# EAGLE design playPack (EAGLE 5.11)
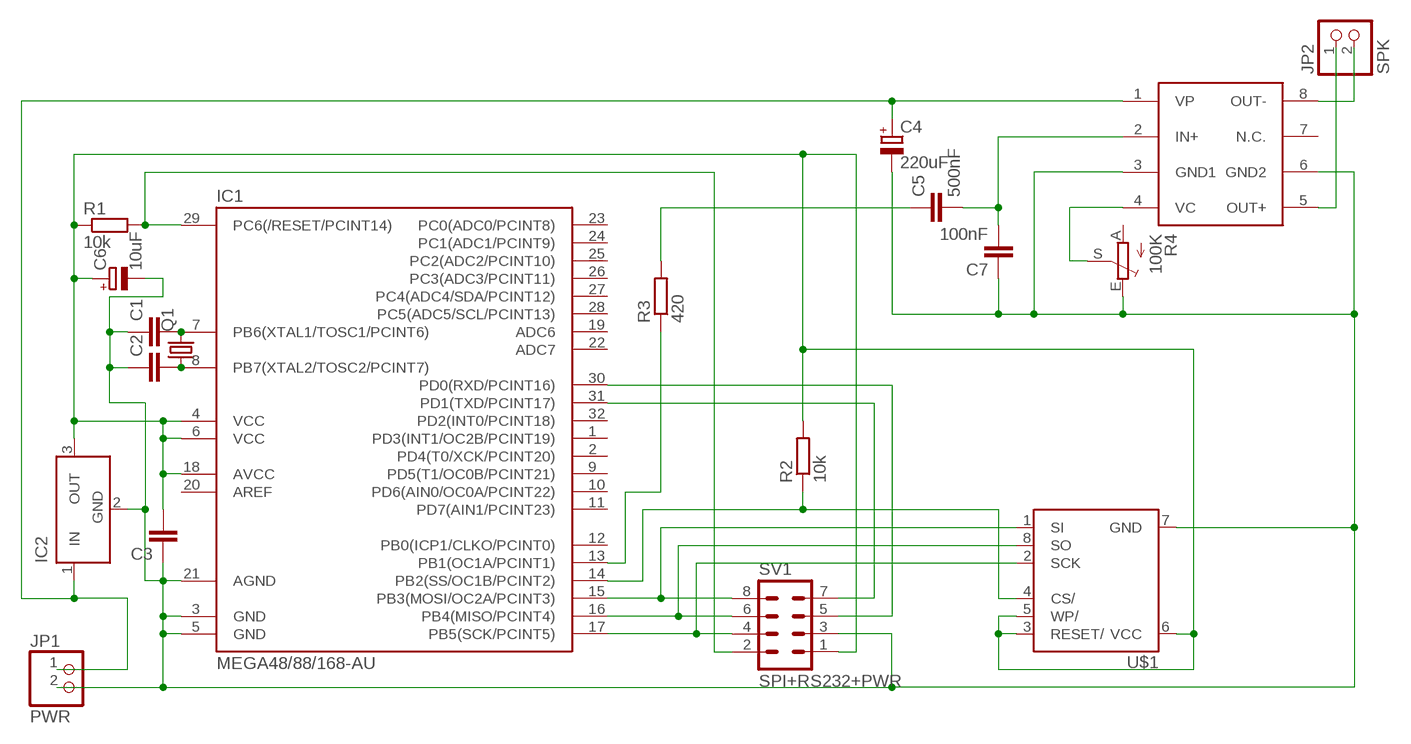
[diagram p0: schematic, sheet 1]

## Parts
C1  C-EUC0603  [C0603]
C2  C-EUC0603  [C0603]
C3  C-EUC0603  [C0603]
C4  220uF  CPOL-EUE2,5-6E  [E2,5-6E]
C5  500nF  C-EUC0402  [C0402]
C6  10uF  CPOL-EUE1.8-4  [E1,8-4]
C7  100nF  C-EUC0402  [C0402]
IC1  MEGA48/88/168-AU  [TQFP32-08]
IC2  LT1129CST5  [SOT223]
JP1  PWR  PINHD-1X2  [1X02]
JP2  SPK  PINHD-1X2  [1X02]
Q1  CRYTALHC49U-V  [HC49U-V]
R1  10k  R-EU_R0603  [R0603]
R2  10k  R-EU_R0603  [R0603]
R3  420  R-EU_R0603  [R0603]
R4  100K  TRIM_EU-LI10  [LI10]
SV1  SPI+RS232+PWR  MA04-2  [MA04-2]
U$1  AT45SO  [SOIC8]
U$2  TDA7052A  [SO8]

## Nets
#RESET: IC1.29(PC6(/RESET/PCINT14)) R1.2 SV1.2
GND: C1.1 C2.1 C3.1 C4.- C6.- C7.1 IC1.3(GND) IC1.5(GND) IC1.21(AGND) IC2.2(GND) JP1.2 R4.E SV1.3 U$1.7(GND) U$2.3(GND1) U$2.6(GND2)
MISO: IC1.16(PB4(MISO/PCINT4)) SV1.6 U$1.8(SO)
MOSI: IC1.15(PB3(MOSI/OC2A/PCINT3)) SV1.8 U$1.1(SI)
N$1: C5.1 R3.2
N$8: C1.2 IC1.7(PB6(XTAL1/TOSC1/PCINT6)) Q1.2
N$9: C2.2 IC1.8(PB7(XTAL2/TOSC2/PCINT7)) Q1.1
N$10: JP2.1 U$2.5(OUT+)
N$11: JP2.2 U$2.8(OUT-)
N$12: R4.S U$2.4(VC)
N$17: C5.2 C7.2 U$2.2(IN+)
PWM: IC1.13(PB1(OC1A/PCINT1)) R3.1
RXD: IC1.30(PD0(RXD/PCINT16)) SV1.5
SCK: IC1.17(PB5(SCK/PCINT5)) SV1.4 U$1.2(SCK)
SS: IC1.14(PB2(SS/OC1B/PCINT2)) R2.1 U$1.4(CS/)
TXD: IC1.31(PD1(TXD/PCINT17)) SV1.7
V33: C3.2 C6.+ IC1.4(VCC) IC1.6(VCC) IC1.18(AVCC) IC2.3(OUT) R1.1 R2.2 SV1.1 U$1.3(RESET/) U$1.5(WP/) U$1.6(VCC)
VCC: C4.+ IC2.1(IN) JP1.1 U$2.1(VP)
Unconnected: IC1.1(PD3(INT1/OC2B/PCINT19)) IC1.2(PD4(T0/XCK/PCINT20)) IC1.9(PD5(T1/OC0B/PCINT21)) IC1.10(PD6(AIN0/OC0A/PCINT22)) IC1.11(PD7(AIN1/PCINT23)) IC1.12(PB0(ICP1/CLKO/PCINT0)) IC1.19(ADC6) IC1.20(AREF) IC1.22(ADC7) IC1.23(PC0(ADC0/PCINT8)) IC1.24(PC1(ADC1/PCINT9)) IC1.25(PC2(ADC2/PCINT10)) IC1.26(PC3(ADC3/PCINT11)) IC1.27(PC4(ADC4/SDA/PCINT12)) IC1.28(PC5(ADC5/SCL/PCINT13)) IC1.32(PD2(INT0/PCINT18)) R4.A U$2.7(N.C.)

## Power pins joined to a net without a drawn wire
GND: IC2.4(GND)

## Library data of the parts
C1-C3 C5 C7 = rcl:C-EU: CAPACITOR, European symbol
C4 C6 = rcl:CPOL-EU: POLARIZED CAPACITOR, European symbol
IC1 = avr-4:MEGA48/88/168
IC2 = linear-technology:LT1129CST5: VOLTAGE REGULATOR with shutdown
JP1 JP2 = pinhead:PINHD-1X2: PIN HEADER
Q1 = crystal:CRYTAL: CRYSTAL
R1-R3 = rcl:R-EU_: RESISTOR, European symbol
R4 = pot:TRIM_EU-: POTENTIOMETER
SV1 = con-lstb:MA04-2: PIN HEADER
U$1 = at45dataflash:AT45*: ATMEL AT45DB041 AT45DB081 Dataflash 1 / 2 / 4 / 8 MBit SO8
U$2 = playPack:TDA7052A

## Board
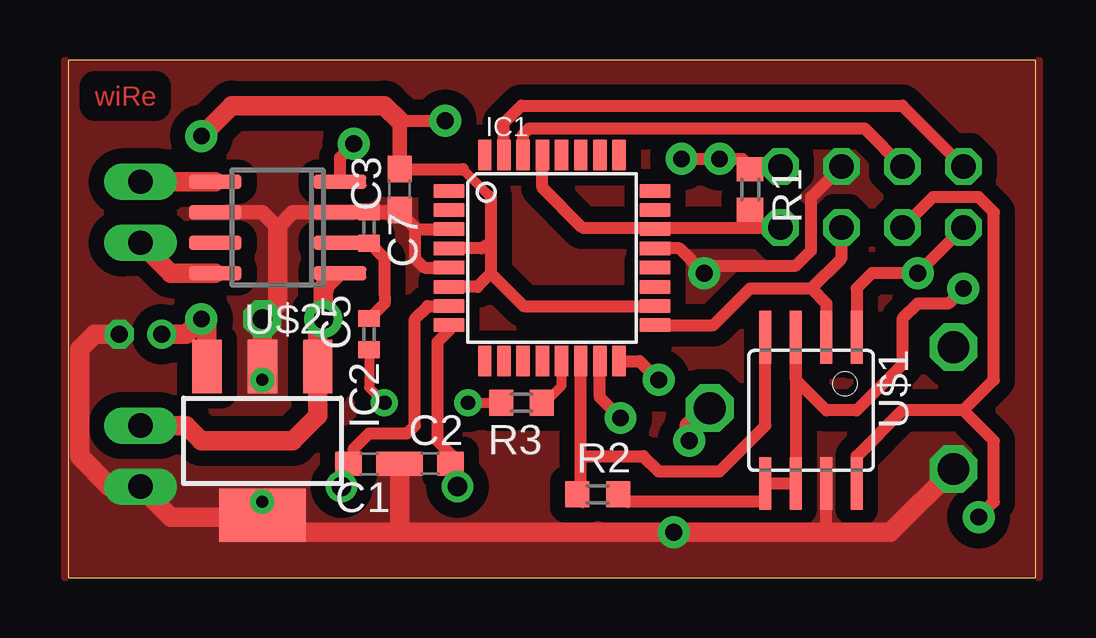
[diagram p1: board, top side]
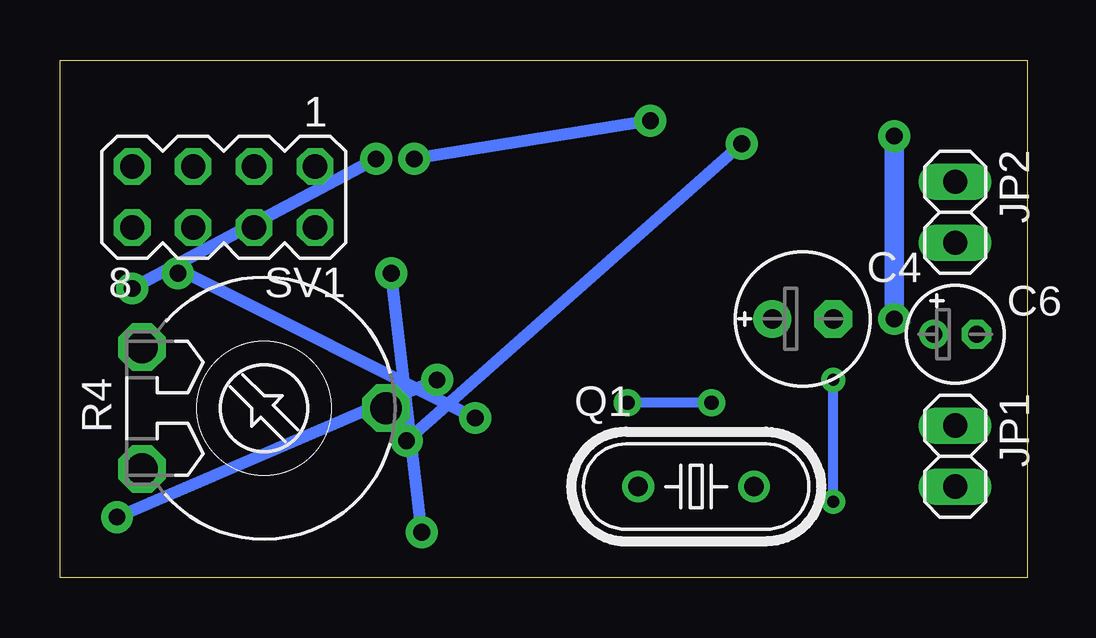
[diagram p2: board, bottom side, seen from below]

Size 40.31 x 21.58 mm. Coordinates in mm from the lower left corner, seen from the top.
Outline: 0,0 40.31,0 40.31,21.58 0,21.58 0,0
Copper layers (1*16): Top 0.035mm / dielectric 1.5mm / Bottom 0.035mm
Design rules "default": minimum track width 10mil, minimum drill 24mil, track to track 25mil, track to pad 25mil, pad to pad 25mil, via to via 25mil, smd to smd 8mil, copper to edge 1mil, drill to drill 1mil, minimum pad ring 10mil, minimum via ring 10mil, stop-mask expansion 4mil, vias tented up to drill 0mil, thermal gap 10mil

### Footprints (pad centres in the part's own frame; a part is rotated, then mirrored left to right if it is on the bottom)
C0603 = smd 1.1 x 1: 1 -0.85,0; 2 0.85,0
E2,5-6E = drill 0.813 pad 1.575 round: + -1.27,0 | drill 0.813 pad 1.575 octagon: - 1.27,0
C0402 = smd 0.7 x 0.9: 1 -0.65,0; 2 0.65,0
E1,8-4 = drill 0.711 pad 1.168 round: + -0.889,0 | drill 0.711 pad 1.168 octagon: - 0.889,0
TQFP32-08 = smd 1.27 x 0.559: 1 -4.293,2.8; 2 -4.293,2; 3 -4.293,1.2; 4 -4.293,0.4; 5 -4.293,-0.4; 6 -4.293,-1.2; 7 -4.293,-2; 8 -4.293,-2.8; 17 4.293,-2.8; 18 4.293,-2; 19 4.293,-1.2; 20 4.293,-0.4; 21 4.293,0.4; 22 4.293,1.2; 23 4.293,2; 24 4.293,2.8 | smd 0.559 x 1.27: 9 -2.8,-4.293; 10 -2,-4.293; 11 -1.2,-4.293; 12 -0.4,-4.293; 13 0.4,-4.293; 14 1.2,-4.293; 15 2,-4.293; 16 2.8,-4.293; 25 2.8,4.293; 26 2,4.293; 27 1.2,4.293; 28 0.4,4.293; 29 -0.4,4.293; 30 -1.2,4.293; 31 -2,4.293; 32 -2.8,4.293
SOT223 = smd 1.219 x 2.235: 1 -2.311,-3.099; 2 0,-3.099; 3 2.311,-3.099 | smd 3.6 x 2.2: 4 0,3.099
1X02 = drill 1.016 long: 1 -1.27,0; 2 1.27,0
HC49U-V = drill 0.813 round: 1 -2.413,0; 2 2.413,0
R0603 = smd 1 x 1.1: 1 -0.85,0; 2 0.85,0
LI10 = drill 1.321 octagon: A -2.54,-5.08; E 2.54,-5.08; S 0,5.08
MA04-2 = drill 1.016 octagon: 1 -3.81,-1.27; 2 -3.81,1.27; 3 -1.27,-1.27; 4 -1.27,1.27; 5 1.27,-1.27; 6 1.27,1.27; 7 3.81,-1.27; 8 3.81,1.27
SOIC8 = smd 0.5 x 2.2: 1 -1.905,-3.048; 2 -0.635,-3.048; 3 0.635,-3.048; 4 1.905,-3.048; 5 1.905,3.048; 6 0.635,3.048; 7 -0.635,3.048; 8 -1.905,3.048
SO8 = smd 0.6 x 2.2: 1 0.635,1.21; 2 1.905,1.21; 3 3.175,1.21; 4 4.445,1.21; 5 4.445,6.41; 6 3.175,6.41; 7 1.905,6.41; 8 0.635,6.41

### Placement (x,y rotation side)
C1  12.54,4.76 180 top
C2  15.08,4.76 0 top
C3  13.8,16.19 90 top
C4  9.36,10.79 0 bottom
C5  12.54,10.16 90 top
C6  3.01,10.16 0 bottom
C7  12.54,14.6 270 top
IC1  20.15,13.33 0 top
IC2  8.09,5.71 180 top
JP1  3.01,5.07 270 bottom
JP2  3.01,15.24 270 bottom
Q1  13.8,3.8 0 bottom
R1  28.41,16.19 270 top
R2  22.06,3.49 0 top
R3  18.88,7.3 180 top
R4  31.81,7.07 270 bottom
SV1  33.49,15.87 180 bottom
U$1  30.95,6.98 180 top
U$2  12.54,12.06 90 top

### Tracks (layer width: path | path; a pad name or v marks a point on that pad's centre or on a via)
#RESET
  Top 0.406: 28.41,14.6 R1.2
  Top 0.508: IC1.29 19.75,16.27 21.42,14.6 28.41,14.6 SV1.2
GND  (via drill 0.5, 0.7)
  Top 0.406: 8.09,2.54 v8.09,3.17 | v8.09,8.25 8.09,8.88
  Top 0.508: IC1.3 14.51,14.53 14.44,14.6 | 13.8,15.24 14.44,14.6 | IC1.5 14.84,12.93 14.44,13.33 14.44,14.6 | SV1.3 30.95,15.87 30.95,13.65 30.31,13.01 26.82,13.01 v26.5,12.7 25.47,13.73 IC1.21 | 31.58,1.9 U$1.7
  Top 0.61: IC2.4 9.08,2.25 8.8,1.9 9.36,1.9 11.9,1.9 | U$2.6 8.09,15.24 8.72,14.6 9.36,15.24 11.27,15.24 | 11.27,15.24 U$2.3 | 11.27,15.24 13.8,15.24 C3.1 | C1.1 13.49,4.76 13.8,4.44 14.12,4.76 C2.1
  Top 0.813: 9.08,2.25 9.36,1.9 13.8,1.9 | 13.8,1.9 13.8,4.44 13.8,4.76 | IC2.4 8.09,2.54 4.28,2.54 JP1.2 1.74,3.8 0.47,5.07 0.47,9.52 1.1,10.16 C6.- | IC2.2 8.09,8.88 C4.- 8.72,11.43 8.72,14.6 | 13.8,1.9 v25.23,1.9 31.58,1.9 34.26,1.9 R4.E
  Bottom 0.406: v8.09,3.17 v8.09,8.25
  Bottom 0.508: v25.23,1.9 v26.5,12.7
  pour Top (no thermals): -0.17,21.58 40.48,21.58 40.48,-0.01 -0.17,-0.01
MISO  (via drill 0.7)
  Top 0.508: SV1.6 36.03,15.87 37.94,15.87 38.57,15.24 38.57,8.25 37.3,6.98 | 37.3,6.98 34.76,6.98 32.85,5.07 U$1.8 32.85,3.8 | v24.6,8.25 23.81,9.04 IC1.16 | v37.94,2.54 38.57,3.17 38.57,5.71 37.3,6.98
  Bottom 0.508: v24.6,8.25 v37.94,2.54
MOSI  (via drill 0.7)
  Top 0.508: U$1.1 32.85,12.06 33.49,12.7 v35.4,12.7 SV1.8 | IC1.15 22.15,7.52 v23.01,6.66
  Bottom 0.508: v23.01,6.66 35.08,12.7 v35.4,12.7
N$1  (via drill 0.6)
  Top 0.406: C5.1 12.54,7.93 v13.17,7.3 | v16.66,7.3 R3.2
  Bottom 0.406: v13.17,7.3 v16.66,7.3
N$8
  Top 0.508: Q1.2 11.39,4.25 11.9,4.76 | IC1.7 14.98,11.33 14.44,10.79 14.44,6.35 14.12,6.03 12.54,6.03 11.9,5.39 11.9,4.76 | 11.9,4.76 C1.2
N$9
  Top 0.508: Q1.1 16.22,4.25 15.71,4.76 | 15.71,4.76 C2.2 15.93,4.97 16.03,5.07 15.39,5.71 15.39,9.84 15.86,10.31 IC1.8 | 15.71,4.76 15.86,4.91
N$10
  Top 0.813: JP2.1 U$2.5
N$11
  Top 0.813: U$2.8 4.28,12.7 JP2.2
N$12  (via drill 0.7)
  Top 0.508: U$2.4 11.33,17.52 v11.9,18.09
  Top 0.813: R4.S 26.6,7.07 25.87,6.35 v25.87,5.71
  Bottom 0.508: v11.9,18.09 v25.87,5.71
N$17
  Top 0.406: 12.54,13.96 C7.2
  Top 0.508: U$2.2 12.54,13.96 13.17,13.33 13.17,12.06 13.19,11.44 C5.2
PWM
  Top 0.406: IC1.13 20.55,8.02 19.52,6.98 R3.1
RXD
  Top 0.508: IC1.30 18.95,18.48 19.2,18.73 33.17,18.73 SV1.5
SCK
  Top 0.508: SV1.4 32.22,13.33 30.95,12.06 | 30.95,12.06 31.58,11.43 U$1.2 | IC1.17 26.88,10.53 28.41,12.06 30.95,12.06
SS
  Top 0.508: 21.21,3.38 21.42,3.17 | R2.1 21.21,3.38 | 21.35,5.07 21.35,3.88 21.21,3.38 | 21.35,5.07 IC1.14 | U$1.4 29.04,6.35 27.14,4.44 24.6,4.44 23.96,5.07 21.35,5.07
TXD
  Top 0.508: IC1.31 18.15,18.95 18.88,19.68 34.76,19.68 SV1.7
V33  (via drill 0.7)
  Top 0.406: 16.45,17.04 17.61,15.87
  Top 0.508: IC1.6 17.05,12.13 17.61,12.7 | IC1.4 17.21,13.73 17.61,13.96 | 17.61,13.96 17.61,12.7 | C3.2 16.45,17.04 | 17.61,15.87 17.61,13.96 | IC1.18 18.98,11.33 17.61,12.7 | 28.41,17.14 SV1.1 | 13.8,19.04 v15.71,19.04 | U$1.3 30.31,10.16 | U$1.3 U$1.6 30.31,4.12 30.12,3.93 U$1.5 29.04,3.17 23.33,3.17 23.01,3.49 R2.2 22.91,3.59 | U$1.3 30.31,8.25 31.58,6.98 32.85,6.98 34.76,8.88 34.76,10.79 35.4,11.43 36.66,11.43 v37.3,12.06 | 29.04,17.14 R1.1 28.41,17.14 | v25.55,17.46 v27.14,17.46 28.09,17.46 28.41,17.14
  Top 0.61: 13.8,19.04 C3.2
  Top 0.813: IC2.3 5.78,10.56 v5.55,10.79 4.92,10.16 C6.+ | v5.55,18.41 6.82,19.68 13.17,19.68 13.8,19.04
  Bottom 0.508: v15.71,19.04 v25.55,17.46 | v27.14,17.46 v37.3,12.06
  Bottom 0.813: v5.55,10.79 v5.55,18.41
VCC
  Top 0.61: 10.63,12 10.66,12.03 U$2.1
  Top 0.813: 10.66,12.03 10.63,12.06 C4.+ 10.4,10.56 IC2.1 10.4,6.75 9.36,5.71 5.55,5.71 4.92,6.35 JP1.1

### Text on the board
Top: wiRe